# Altium schematic sheet SectionC_BreakOut.SchDoc
size A3
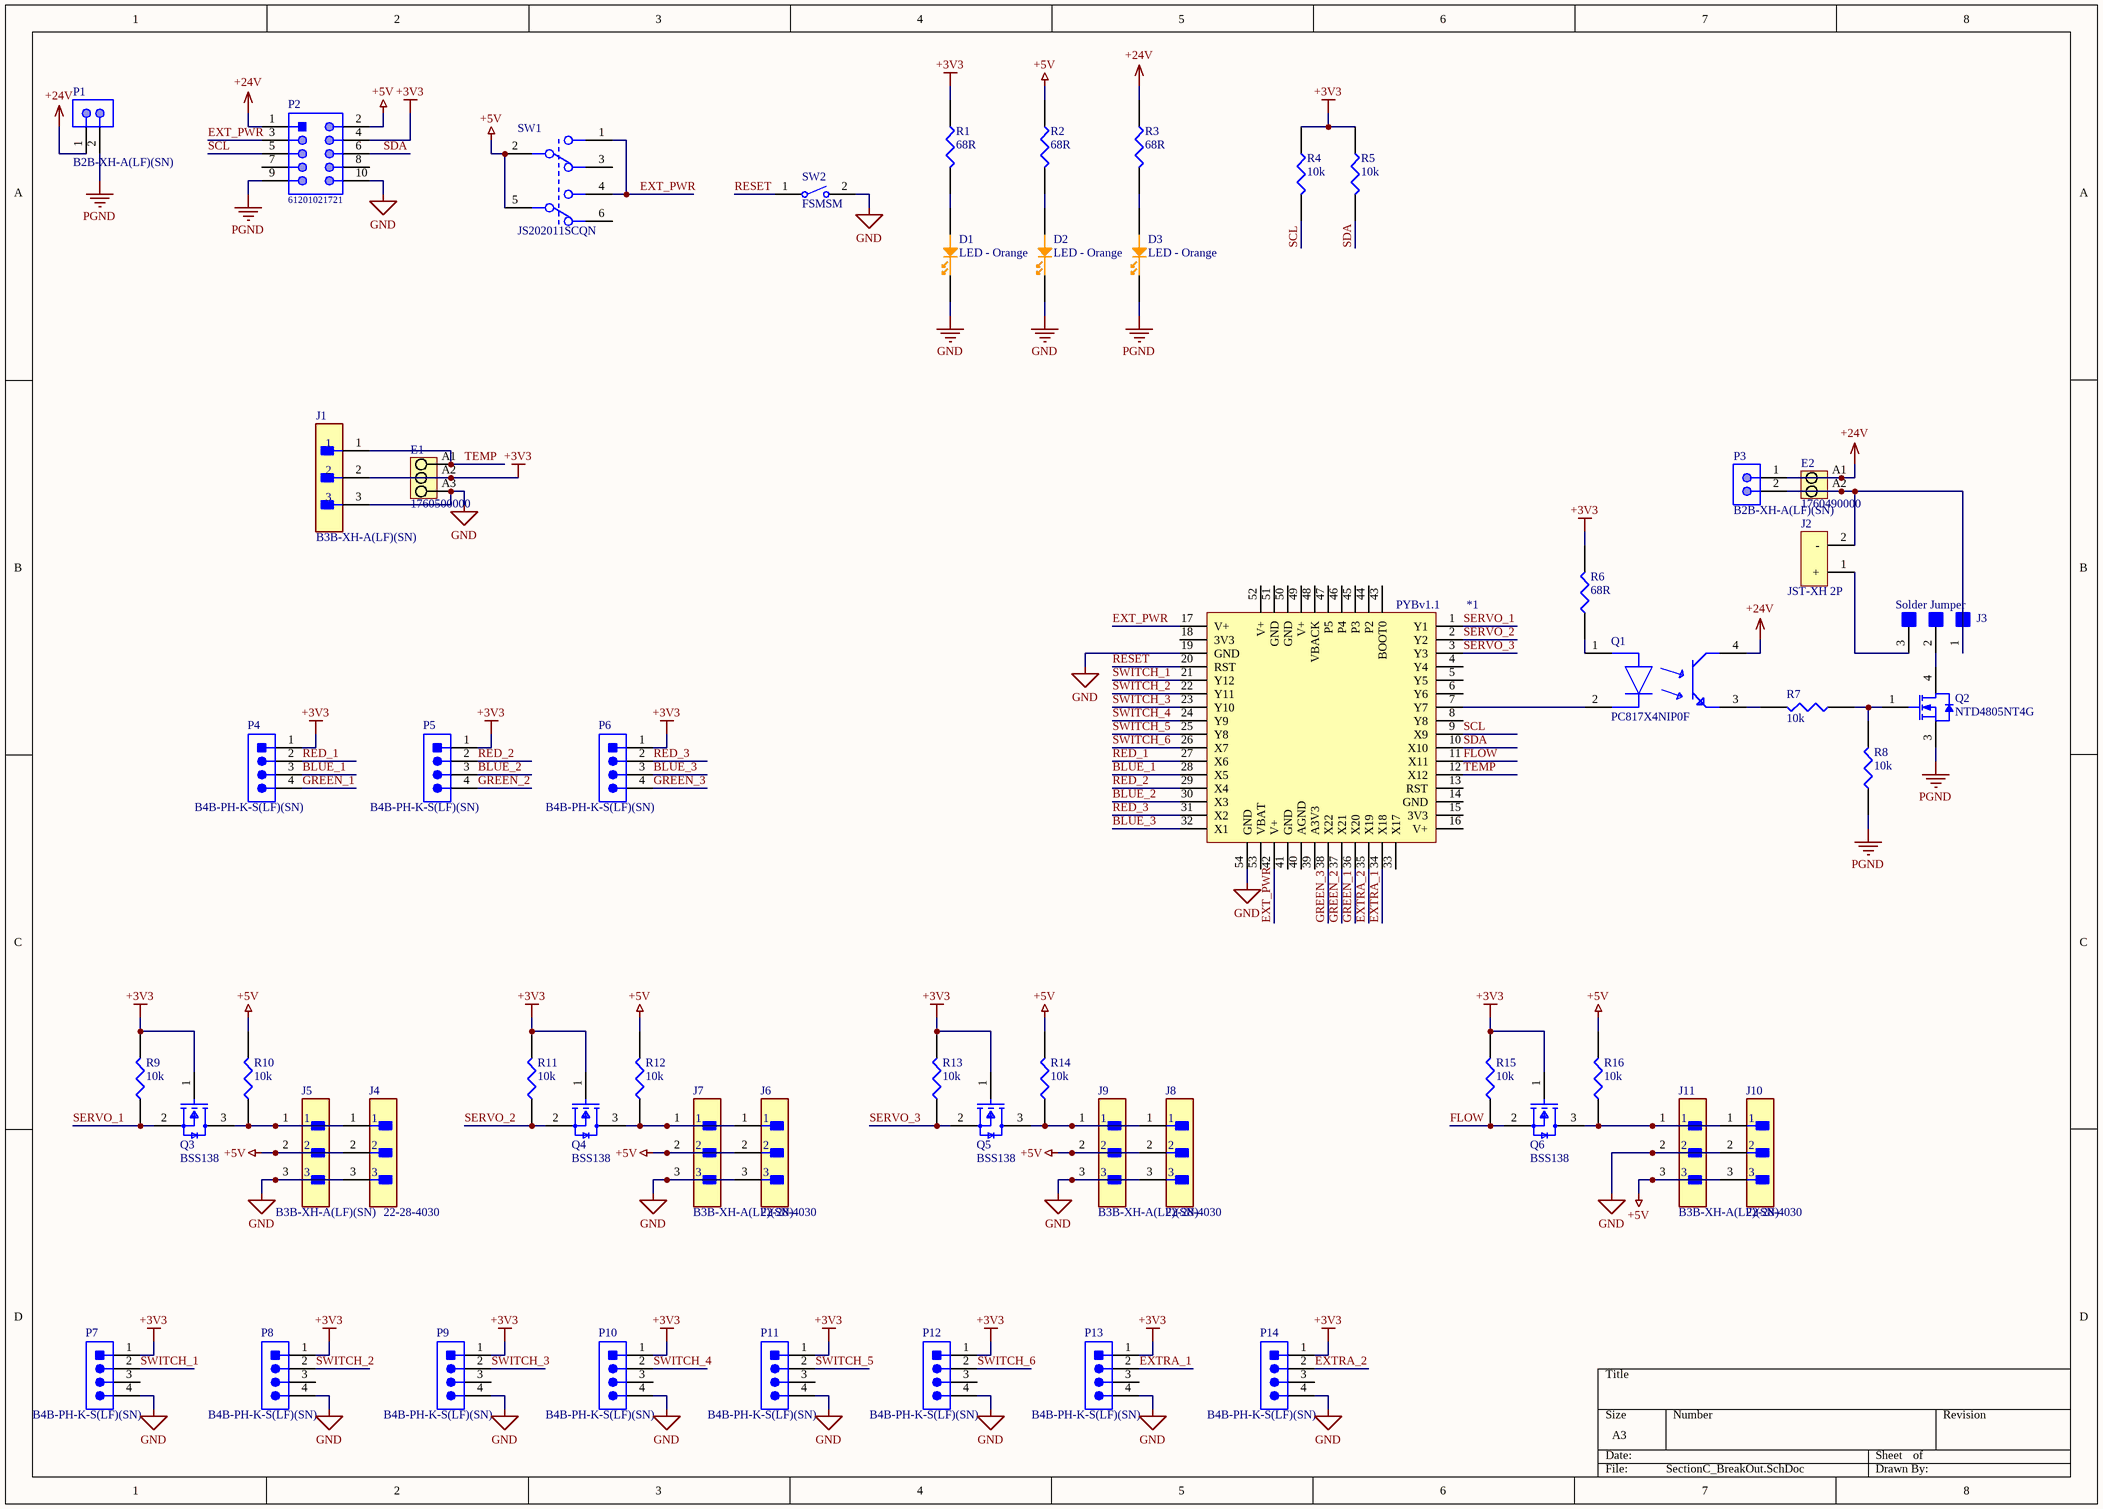
[diagram p0: SectionC_BreakOut.SchDoc]

## Parts
*1  PYBv1.1  [PYBv1.1]
D1  LED - Orange  [LED0603-Orange]
D2  LED - Orange  [LED0603-Orange]
D3  LED - Orange  [LED0603-Orange]
E1  1760500000  [PM_5_08_90_03]
E2  1760490000  [PM_5_08_90_02]
J1  B3B-XH-A(LF)(SN)  [FP-B3B-XH-A_LF_SN-MFG]
J2  JST-XH 2P  [JST-XH 2P]
J3  Solder Jumper  [Solder Jumper]
J4  22-28-4030  [FP-22-28-4030-MFG]
J5  B3B-XH-A(LF)(SN)  [FP-B3B-XH-A_LF_SN-MFG]
J6  22-28-4030  [FP-22-28-4030-MFG]
J7  B3B-XH-A(LF)(SN)  [FP-B3B-XH-A_LF_SN-MFG]
J8  22-28-4030  [FP-22-28-4030-MFG]
J9  B3B-XH-A(LF)(SN)  [FP-B3B-XH-A_LF_SN-MFG]
J10  22-28-4030  [FP-22-28-4030-MFG]
J11  B3B-XH-A(LF)(SN)  [FP-B3B-XH-A_LF_SN-MFG]
P1  B2B-XH-A(LF)(SN)  [JST-B2B-XH-A_V]
P2  61201021721  [61201021721]
P3  B2B-XH-A(LF)(SN)  [JST-B2B-XH-A_V]
P4  B4B-PH-K-S(LF)(SN)  [JST-B4B-PH-K-S_V]
P5  B4B-PH-K-S(LF)(SN)  [JST-B4B-PH-K-S_V]
P6  B4B-PH-K-S(LF)(SN)  [JST-B4B-PH-K-S_V]
P7  B4B-PH-K-S(LF)(SN)  [JST-B4B-PH-K-S_V]
P8  B4B-PH-K-S(LF)(SN)  [JST-B4B-PH-K-S_V]
P9  B4B-PH-K-S(LF)(SN)  [JST-B4B-PH-K-S_V]
P10  B4B-PH-K-S(LF)(SN)  [JST-B4B-PH-K-S_V]
P11  B4B-PH-K-S(LF)(SN)  [JST-B4B-PH-K-S_V]
P12  B4B-PH-K-S(LF)(SN)  [JST-B4B-PH-K-S_V]
P13  B4B-PH-K-S(LF)(SN)  [JST-B4B-PH-K-S_V]
P14  B4B-PH-K-S(LF)(SN)  [JST-B4B-PH-K-S_V]
Q1  PC817X4NIP0F  [FP-PC817X4NIP0F-MFG]
Q2  NTD4805NT4G  [ONSC-DPAK-3-369AA-01_V]
Q3  BSS138  [FP-318-08-IPC_B]
Q4  BSS138  [FP-318-08-IPC_B]
Q5  BSS138  [FP-318-08-IPC_B]
Q6  BSS138  [FP-318-08-IPC_B]
R1  68R  [68R 0603]
R2  68R  [68R 0603]
R3  68R  [68R 0603]
R4  10k  [10k R0603]
R5  10k  [10k R0603]
R6  68R  [68R 0603]
R7  10k  [10k R0603]
R8  10k  [10k R0603]
R9  10k  [10k R0603]
R10  10k  [10k R0603]
R11  10k  [10k R0603]
R12  10k  [10k R0603]
R13  10k  [10k R0603]
R14  10k  [10k R0603]
R15  10k  [10k R0603]
R16  10k  [10k R0603]
SW1  JS202011SCQN  [FP-JS202011SCQN-MFG]
SW2  FSMSM  [TECO-FSMSM-2_V]

## Nets
+3V3: E1.A2 J1.2 P2.4 P4.1 P5.1 P6.1 P7.1 P8.1 P9.1 P10.1 P11.1 P12.1 P13.1 P14.1 Q3.1(G) Q4.1(G) Q5.1(G) Q6.1(G) R1.1 R4.1 R5.1 R6.2 R9.2 R11.2 R13.2 R15.2
+5V: J4.2 J5.2 J6.2 J7.2 J8.2 J9.2 J10.3 J11.3 P2.2 R2.1 R10.2 R12.2 R14.2 R16.2 SW1.2 SW1.5
+24V: E2.A1 P1.1 P2.1 P3.1 Q1.4(C) R3.1
GND: *1.19(GND) *1.54(GND) D1.1(Cathode) D2.1(Cathode) E1.A3 J1.3 J4.3 J5.3 J6.3 J7.3 J8.3 J9.3 J10.2 J11.2 P2.10 P7.4 P8.4 P9.4 P10.4 P11.4 P12.4 P13.4 P14.4 SW2.2
PGND: D3.1(Cathode) P1.2 P2.9 Q2.3(S) R8.1
BLUE_1: *1.28(X5) P4.3
BLUE_2: *1.30(X3) P5.3
BLUE_3: *1.32(X1) P6.3
EXT_PWR: *1.17(V+) *1.42(V+) P2.3 SW1.1 SW1.4
EXTRA_1: *1.34(X18) P13.2
EXTRA_2: *1.35(X19) P14.2
FLOW: *1.11(X11) Q6.2(S) R15.1
GREEN_1: *1.36(X20) P4.4
GREEN_2: *1.37(X21) P5.4
GREEN_3: *1.38(X22) P6.4
RED_1: *1.27(X6) P4.2
RED_2: *1.29(X4) P5.2
RED_3: *1.31(X2) P6.2
RESET: *1.20(RST) SW2.1
SCL: *1.9(X9) P2.5 R4.2
SDA: *1.10(X10) P2.6 R5.2
SERVO_1: *1.1(Y1) Q3.2(S) R9.1
SERVO_2: *1.2(Y2) Q4.2(S) R11.1
SERVO_3: *1.3(Y3) Q5.2(S) R13.1
SWITCH_1: *1.21(Y12) P7.2
SWITCH_2: *1.22(Y11) P8.2
SWITCH_3: *1.23(Y10) P9.2
SWITCH_4: *1.24(Y9) P10.2
SWITCH_5: *1.25(Y8) P11.2
SWITCH_6: *1.26(X7) P12.2
TEMP: *1.12(X12) E1.A1 J1.1
Net*1_7: *1.7(Y7) Q1.2(C)
NetD1_2: D1.2(Anode) R1.2
NetD2_2: D2.2(Anode) R2.2
NetD3_2: D3.2(Anode) R3.2
NetE2_A2: E2.A2 J2.2(-) J3.1 P3.2
NetJ2_1: J2.1(+) J3.3
NetJ3_2: J3.2 Q2.4(D)
NetJ4_1: J4.1 J5.1 Q3.3(D) R10.1
NetJ6_1: J6.1 J7.1 Q4.3(D) R12.1
NetJ8_1: J8.1 J9.1 Q5.3(D) R14.1
NetJ10_1: J10.1 J11.1 Q6.3(D) R16.1
NetQ1_1: Q1.1(A) R6.1
NetQ1_3: Q1.3(E) R7.2
NetQ2_1: Q2.1(G) R7.1 R8.2

Not connected (* = marked no-connect by the designer): *1 4(Y4) 5(Y5) 6(Y6) 8(Y8) 13(RST) 14(GND) 15(3V3) 16(V+) 18(3V3) 33(X17) 39(A3V3) 40(AGND) 41(GND) 43(BOOT0) 44(P2) 45(P3) 46(P4) 47(P5) 48(VBACK) 49(V+) 50(GND) 51(GND) 52(V+) 53(VBAT); P2 7 8; P7 3; P8 3; P9 3; P10 3; P11 3; P12 3; P13 3; P14 3; SW1 3 6

## Library data of the parts
D1-D3 = LTST-C191KFKT: LED ORANGE CLEAR SMD; Manufacturer: Vishay Lite-On; Lens Color: Colorless; Wavelength: 611nm; Number of LEDs: 1; Viewing Angle: 130°; Lens Style: Diffused,Colorless,Rectangular; Luminous Intensity: 90mcd; Forward Current: 30mA; Forward Voltage: 2V; Power Rating: 75mW; Reverse Voltage: 5V; Dominant Wavelength: 605nm; Test Current: 20mA; Supplier 1: Digi-Key; Supplier Part Number 1: 160-1445-1-ND; Manufacturer Part Number: LTST-C191KFKT; RoHS: Yes; Category: LEDs; Stock 1: 92562; Pricing 1: 1=0.24000, 10=0.17900, 100=0.08460, 500=0.05640, 1000=0.04418, 2500=0.04324 (USD); Mount: Surface Mount; Case/Package: 0603; Number of Pins: 2; Case Code (Metric): 1608; Color: Orange; Case Code (Imperial): 0603; Min Operating Temperature: -55°C; Max Operating Temperature: 85°C; Package Quantity: 1; Packaging: Tape and Reel; Illumination Color: Orange; Lens Transparency: Clear; Number of Elements: 1; Power Dissipation: 75mW; Length: 1.6mm; Height: 0.55mm; Width: 0.8mm; Depth: 0.8mm; Radiation Hardening: No; Lead Free: Lead Free; ComponentLink1URL: https://datasheet.ciiva.com/2109/ltst-c191kfkt-2109968.pdf?src-supplier=Digi-Key; ComponentLink1Description: https://datasheet.ciiva.com/2109/ltst-c191kfkt-2109968.pdf?src-supplier=Digi-Key; ComponentLink2URL: https://datasheet.ciiva.com/12400/100-ltst-c191kfkt-39904-12400811.pdf?src-supplier=Mouser; ComponentLink2Description: https://datasheet.ciiva.com/12400/100-ltst-c191kfkt-39904-12400811.pdf?src-supplier=Mouser; ComponentLink3URL: https://datasheet.ciiva.com/11775/0900766b80dc02b0-11775613.pdf?src-supplier=RSComponents; ComponentLink3Description: https://datasheet.ciiva.com/11775/0900766b80dc02b0-11775613.pdf?src-supplier=RSComponents; ComponentLink4URL: https://datasheet.ciiva.com/15201/getdatasheetpartid-631075-15201391.pdf?src-supplier=Verical; ComponentLink4Description: https://datasheet.ciiva.com/15201/getdatasheetpartid-631075-15201391.pdf?src-supplier=Verical; ComponentLink5URL: https://datasheet.ciiva.com/2109/s-110-ltst-c191kfkt-2109969.pdf?src-supplier=Digi-Key; ComponentLink5Description: https://datasheet.ciiva.com/2109/s-110-ltst-c191kfkt-2109969.pdf?src-supplier=Digi-Key
E1 = CMP-1559-01629-1: OMNIMATE Signal - series PM; Manufacturer: Weidmueller; Pitch_mm: 5,08 mm; Pitch_inch: 0,2 inch; Wire_cross_section_AWG_min_UL_1059: AWG 26; Contact_surface: tinned; Contact_material: Cu-Leg; Short_text_for_material: PM 5.08/03/90 3.5SN OR BX; Rated_voltage_use_group_B_UL_1059: 300 V; Solid_min_H05_07_V_U: 0,13 mm²; Solder_pin_length_mm: 3,5 mm; Rated_voltage_for_surge_voltage_class_pollution_degree_II_2: 600 V; Mounting_onto_the_PCB: Solder connection; Solid_max_H05_07_V_U: 2,5 mm²; Side_termination_characteristic: closed side; Rated_current_use_group_B_UL_1059: 15 A; Wire_cross_section_AWG_max_UL_1059: AWG 14; Insulating_material: Wemid (PA); UL_94_flammability_rating: V-0; No_of_poles: 3; ComponentLink2Description: URL Link1; ComponentLink1Description: Manufacturer URL; PartNumber: 1760500000; ComponentLink2URL: http://catalog.weidmueller.com/catalog/Start.do?localeId=en&ObjectID=1760500000; ComponentLink1URL: http://www.weidmueller.com/; Qty: 500 PCS; Colour: Orange; Packaging: Box; Revision: V1; PackageReference: PM_5_08_90_03
E2 = CMP-1559-01627-1: OMNIMATE Signal - series PM; Manufacturer: Weidmueller; Contact_surface: tinned; Pitch_mm: 5,08 mm; Solid_min_H05_07_V_U: 0,13 mm²; Wire_cross_section_AWG_min_UL_1059: AWG 26; Wire_cross_section_AWG_max_UL_1059: AWG 14; Rated_voltage_for_surge_voltage_class_pollution_degree_II_2: 600 V; Rated_current_use_group_B_UL_1059: 15 A; Mounting_onto_the_PCB: Solder connection; Solder_pin_length_mm: 3,5 mm; Side_termination_characteristic: closed side; Contact_material: Cu-Leg; Pitch_inch: 0,2 inch; No_of_poles: 2; UL_94_flammability_rating: V-0; Insulating_material: Wemid (PA); Rated_voltage_use_group_B_UL_1059: 300 V; Solid_max_H05_07_V_U: 2,5 mm²; Short_text_for_material: PM 5.08/02/90 3.5SN OR BX; Revision: V1; PartNumber: 1760490000; Qty: 500 PCS; ComponentLink2Description: URL Link1; Packaging: Box; PackageReference: PM_5_08_90_02; ComponentLink2URL: http://catalog.weidmueller.com/catalog/Start.do?localeId=en&ObjectID=1760490000; Colour: Orange; ComponentLink1Description: Manufacturer URL; ComponentLink1URL: http://www.weidmueller.com/
J1 J5 J7 J9 J11 = CMP-17439-000014-1: CONN HEADER VERT 3POS 2.5MM; Manufacturer: JST; Conn Gender: Male; Conn Orientation: Vertical; Voltage Rating: 250V; Number Of Contacts: 3; Current Rating: 3A; Contact Material: Tin,Copper; Temperature Range Low: -25°C; Octopart: https://octopart.com/b3b-xh-a%28lf%29%28sn%29-jst-3990185; Device Class L3: unset; Device Class L1: Connectors; Lead Free: Yes; Temperature: -25°C to +85°C; Manufacturer Part Number: B3B-XH-A(LF)(SN); Package: 0; ComponentLink2Description: Datasheet; Pitch: 2.5mm; RoHS: TRUE; Category: Conn; Automotive: No; Temperature Range High: +85°C; Height: 7mm; Device Class L2: Headers and Wire Housings; Number Of Rows: 1; Digikey Description: CONN HEADER VERT 3POS 2.5MM; ComponentLink2URL: https://www.jst-mfg.com/product/pdf/eng/eXH.pdf
J2 = B2B-XH-A(LF)(SN): JST-XH 2 POS 2.5mm Solder ST Thru-Hole Box; Manufacturer: JST; Number of Positions: 2; Connector Type: Male Pin; Contact Resistance: 20mR; Max Current Rating: 3A; Max Voltage Rating (AC): 250V; Insulation Resistance: 1GR; Wire/Cable Gauge: 22AWG; Supplier 1: Element14; Supplier Part Number 1: 1516276; Manufacturer Part Number: B2B-XH-A(LF)(SN); RoHS: Yes; Category: FFC / FPC; Stock 1: 165899; Mount: Through Hole; Contact Plating: Tin,Copper,Lead; Color: Natural; Contact Material: Brass; Housing Color: White; Housing Material: Polyamide; Min Operating Temperature: -25°C; Max Operating Temperature: 85°C; Number of Rows: 1; Packaging: Bulk; Termination: Solder; Fastening Type: Detent; Orientation: Straight; Current Rating: 3A; Voltage Rating: 250V; Voltage Rating (AC): 250V; Number of Contacts: 2; Max Voltage Rating (DC): 250V; Length: 7.4mm; Pitch: 2.5mm; Depth: 5.75mm; Lead Pitch: 2.5mm; Lead Free: Lead Free; REACH SVHC: No SVHC; ComponentLink1URL: https://datasheet.ciiva.com/26894/getdatasheetpartid-640357-26894434.pdf?src-supplier=Verical; ComponentLink1Description: https://datasheet.ciiva.com/26894/getdatasheetpartid-640357-26894434.pdf?src-supplier=Verical; ComponentLink2URL: https://datasheet.ciiva.com/11746/0900766b8082653e-11746979.pdf?src-supplier=RSComponents; ComponentLink2Description: https://datasheet.ciiva.com/11746/0900766b8082653e-11746979.pdf?src-supplier=RSComponents; ComponentLink3URL: https://datasheet.ciiva.com/26894/getdatasheetpartid-385291-26894760.pdf?src-supplier=Verical; ComponentLink3Description: https://datasheet.ciiva.com/26894/getdatasheetpartid-385291-26894760.pdf?src-supplier=Verical; ComponentLink4URL: https://datasheet.ciiva.com/8052/5448-8052024.pdf?src-supplier=Element14; ComponentLink4Description: https://datasheet.ciiva.com/8052/5448-8052024.pdf?src-supplier=Element14; ComponentLink5URL: https://datasheet.ciiva.com/20207/523653-20207167.pdf?src-supplier=Rapid+Electronics; ComponentLink5Description: https://datasheet.ciiva.com/20207/523653-20207167.pdf?src-supplier=Rapid+Electronics
J4 J6 J8 J10 = CMP-04776-000098-1: CONN HEADER VERT 3POS 2.54MM; Manufacturer: Molex; Conn Orientation: Vertical; Conn Gender: Male; Current Rating: 4A; Voltage Rating: 500V; Number Of Contacts: 3; Category: Conn; Number Of Rows: 1; Manufacturer Part Number: 22-28-4030; RoHS: TRUE; Package: 22-28-4030; Footprint Url: https://www.molex.com/pdm_docs/sd/022284030_sd.pdf; ComponentLink2Description: Datasheet; Device Class L2: Headers and Wire Housings; Automotive: No; Temperature Range Low: -40°C; Digikey Description: CONN HEADER VERT 3POS 2.54MM; Mouser Description: Headers & Wire Housings 3P VERT HEADER Sn; Contact Material: Gold,Nickel; Pitch: 2.54mm; Device Class L1: Connectors; Lead Free: Yes; Device Class L3: unset; Temperature Range High: +80°C; Octopart: https://octopart.com/0022284030-molex-10476094; ComponentLink2URL: https://www.molex.com/webdocs/datasheets/pdf/en-us/0022284030_PCB_HEADERS.pdf; Height: 8.88mm; Temperature: -40°C to +80°C
P1 P3 = CMP-2000-05888-1: Male Header, Pitch 2.5 mm, 1 x 2 Position, Height 7 mm, Tail Length 3.4 mm, -25 to 85 degC, RoHS, Bulk; Manufacturer: JST; No of Positions: 2; Pitch: 2.5mm; Style/Orientation: StraightHeader/Plug; Datasheet Version: 05/2016; Package Description: Male Header, Pitch 2.5 mm, 1 x 2 Position, Height 7 mm, Tail Length 3.4 mm; Package Reference: B2B-XH-A; Mounting Technology: ThroughHole; Type: ShroudedHeader; Datasheet URL: http://www.jst-mfg.com/product/pdf/eng/eXH.pdf; Manufacturer URL: http://www.jst.com/home2.html; Termination: Crimp
P2 = CMP-1502-00021-1: Male Box Header WR-BHD, THT, Angled, pitch 2.54 mm, 10 pins; Manufacturer: Wurth Elektronik; Pin Number: 10; Contact Resistance: 20mOhm; Working Voltage: 250VAC; Pitch: 2.54mm; Withstanding Voltage: 500VAC; Mounting Technology: THT; Publisher: WurthElektronik; Gender: Male; Part Number: 61201021721; Package Reference: 61201021721; Orientation: Angled; Published Date: August2018; Packaging: Tray; Manufacturer URL: http://www.we-online.de; Operating Temperature: -40to125degC; Datasheet URL: https://katalog.we-online.de/em/datasheet/6120xx21721.pdf
P4-P14 = CMP-2000-05165-1: Male Header, Pitch 2 mm, 1 x 4 Position, Height 6 mm, Tail Length 3.4 mm, -25 to 85 degC, RoHS, Bulk; Manufacturer: JST; No of Positions: 4; Style/Orientation: StraightHeader/Plug; Pitch: 2mm; Datasheet URL: http://datasheet.octopart.com/B4B-PH-K-S%28LF%29%28SN%29-JST-datasheet-10558886.pdf; Type: ShroudedHeader; Manufacturer URL: http://www.jst.com/home2.html; Termination: Crimp; Datasheet Version: Apr-09
Q1 = CMP-65434-000001-1: OPTOISOLATOR 5KV TRANS 4SMD; Manufacturer: Sharp; Collector Emitter Voltage: 80V; Standoff Height: 0.1mm; Power Dissipation: 200mW; Min Current Transfer Ratio: 50%; Reverse Voltage: 6V; Forward Current: 20mA; Forward Voltage: 1.2V; Max Current Transfer Ratio: 600%; Isolation Voltage: 5kVrms; Mouser Description: Transistor Output Optocouplers Photocoupler 300-600% CRT; RoHS: TRUE; ComponentLink2URL: https://www.sharpsde.com/fileadmin/products/Optoelectronics/Isolation%20Devices/Specs%20Photocoupler/PC817XxNIP0F_17Jun08_Spec_ED-04P129A.pdf; Lead Free: Yes; Device Class L1: Optoelectronics; ComponentLink2Description: Datasheet; Device Class L2: Optocouplers; Temperature: -30°C to +100°C; Temperature Range Low: -30°C; Automotive: No; Temperature Range High: +100°C; Octopart: https://octopart.com/pc817x4nip0f-sharp-20650453; Height: 4.6mm; Digikey Description: OPTOISOLATOR 5KV TRANS 4SMD; Category: Trans; Device Class L3: unset; Package: PC817X4NIP0F; Manufacturer Part Number: PC817X4NIP0F; Emiiter Collector Voltage: 6V
Q2 = CMP-1058-00313-1: Power MOSFET, 30 V, 88 A, Single N-Channel, 3-Pin DPAK, Pb-Free, Tape and Reel; Manufacturer: On Semiconductor; Qrr Typ (nC): 18; Coss Typ (pF): 610; VGS(th) Max (V): 2.5; Channel Polarity: N Channel; Crss Typ (pF): 338; V(BR)DSS Min (V): 30; VGS Max (V): 20; ID Max (A): 88; Ciss Typ (pF): 2865; ComponentLink1Description: Manufacturer URL; Configuration: Single; PackageDescription: 3-Pin Flange Mount, Body 6.54 x 6.095 mm, Pitch 2.29 mm; RoHS: Pb-Free; DatasheetVersion: Rev. 7; Mounting Technology: Surface Mount; PackageVersion: Rev. B, 06/2010; ComponentLink1URL: http://www.onsemi.com/; ComponentLink3Description: Package Specification; ComponentLink2URL: http://www.onsemi.cn/pub_link/Collateral/NTD4805N-D.PDF; Packing: Tape and Reel; Package Type: DPAK-3, IPAK-4; PartNumber: NTD4805NT4G; ComponentLink3URL: http://www.onsemi.cn/pub_link/Collateral/369AA.PDF; PackageReference: DPAK-3-369AA-01; ComponentLink2Description: Datasheet
Q3-Q6 = CMP-07173-000101-1: MOSFET N-CH 50V 220MA SOT-23; Turn-Off Delay Time: 20ns; Element Configuration: Single; Rds On Max: 3.5R; Gate to Source Voltage (Vgs): 20V; Threshold Voltage: 1.3V; Number of Elements: 1; Power Dissipation: 360mW; Rise Time: 9ns; Turn-On Delay Time: 2.5ns; Input Capacitance: 27pF; On-State Resistance: 6R; Lead Free: Lead Free; Length: 2.92mm; Width: 1.3mm; Drain to Source Breakdown Voltage: 50V; Min Operating Temperature: -55°C; REACH SVHC: No SVHC; Packaging: Tape and Reel; Radiation Hardening: No; Height: 0.93mm; Drain to Source Voltage (Vdss): 50V; Current Rating: 220mA; Voltage Rating (DC): 50V; Weight: 0.03g; Continuous Drain Current (ID): 220mA; Number of Pins: 3; Nominal Vgs: 1.3V; Max Power Dissipation: 360mW; Fall Time: 9ns; Drain to Source Resistance: 3.5R; Contact Plating: Tin; Case/Package: SOT-23; Package Quantity: 1; Dual Supply Voltage: 50V; Mount: Surface Mount; Termination: SMD/SMT; Max Operating Temperature: 150°C
R1-R3 R6 = CRGP0603F68R: CRGP 0603 68R 1%; Manufacturer: TE Connectivity; Max Power Dissipation: 250mW; Temperature Coefficient: 200ppm/°C; Supplier 1: Digi-Key; Supplier Part Number 1: A130402CT-ND; Manufacturer Part Number: CRGP0603F68R; RoHS: No; Category: Chip SMD Resistors; Stock 1: 49308; Pricing 1: 1=0.14000, 10=0.11400, 100=0.04470, 1000=0.01870, 2500=0.01714 (USD); Case/Package: 0603; Case Code (Imperial): 0603; Case Code (Metric): 1608; Min Operating Temperature: -55°C; Max Operating Temperature: 155°C; Resistor Type: Thick Film; Packaging: Tape and Reel; Resistance: 68R; Tolerance: 1%; Number of Terminations: 2; ComponentLink1URL: https://www.te.com/commerce/DocumentDelivery/DDEController?Action=srchrtrv&amp;DocNm=9-1773463-9&amp;DocType=DS&amp;DocLang=English&src-supplier=Digi-Key; ComponentLink1Description: https://www.te.com/commerce/DocumentDelivery/DDEController?Action=srchrtrv&amp;DocNm=9-1773463-9&amp;DocType=DS&amp;DocLang=English&src-supplier=Digi-Key
R4 R5 R7-R16 = CRG0603F10K/10: RES 10.0K OHM 1/10W 1% 0603; Manufacturer: TE Connectivity; Voltage Rating: 50V; Number of Resistors: 1; Resistance: 10kR; Power Rating: 100mW; Temperature Coefficient: 100ppm/°C; Supplier 1: Digi-Key; Supplier Part Number 1: A121523CT-ND; Manufacturer Part Number: CRG0603F10K/10; RoHS: Yes; Category: Chip SMD Resistors; Stock 1: 172089; Pricing 1: 1=0.10000, 10=0.03100, 100=0.01270, 1000=0.00570, 2500=0.00494, 5000=0.00409 (USD); Mount: Surface Mount; Case/Package: 0603; Weight: 7.1E-05oz; Case Code (Imperial): 0603; Min Operating Temperature: -55°C; Max Operating Temperature: 125°C; Resistor Type: Thick Film; Number of Terminations: 2; Termination: Solder; Packaging: Tape and Reel; Tolerance: 1%; Package Quantity: 10000; Max Power Dissipation: 100mW; Length: 1.6mm; Height: 0.022inch; Depth: 0.8mm; Width: 0.8mm; Radiation Hardening: No; Military Standard: Not; ELV: Compliant; ComponentLink1URL: https://datasheet.ciiva.com/2530/eng-cd-1622829-ba-2530062.pdf?src-supplier=Digi-Key; ComponentLink1Description: https://datasheet.ciiva.com/2530/eng-cd-1622829-ba-2530062.pdf?src-supplier=Digi-Key
SW1 = CMP-10038-000011-1: SWITCH SLIDE DPDT 300MA 6V; Actuator Material: Nylon; Actuator Length: 2mm; Actuator Type: Standard; Contact Resistance: 70mR; Switch Function: On-On; Electrical Life: 5000Cycles; Voltage Rating (DC): 6V; Contact Current Rating: 300mA; Contact Plating: Silver; Throw Configuration: DPDT; REACH SVHC: No SVHC; Length: 9mm; Package Quantity: 1; Min Operating Temperature: -20°C; Contact Material: Copper Alloy; Switch Travel: 2mm; Radiation Hardening: No; Depth: 7.5mm; Packaging: Tape and Reel; Max Voltage Rating (DC): 6V; Housing Material: Nylon; Max Operating Temperature: 85°C; Current Rating: 300mA; Orientation: Vertical; Termination: Gull Wing; Flammability Rating: UL94 V-2; Lead Free: Lead Free; Mount: Surface Mount; Max Current Rating: 300mA
SW2 = CMP-2000-07511-1: FSMSM Push Button Switch, 50 mA, -35 to 85 degC, 2-Pin SMD, RoHS, Bulk; Manufacturer: TE Connectivity; Actuator Length: 1.07mm; Electrical Life: 20000Cycles; Actuator Material: Polyamide; Current Rating: 50mA; Illumination Type: Illuminated; Voltage Rating (DC): 24V; Contact Resistance: 100mOhm; Case\/Package: SMD/SMT; Operating Force: 180gf; Switch Travel: 0.25mm; Max Voltage Rating (DC): 12V; Throw Configuration: SPST; Packaging: LoosePiece; Max Operating Temperature: 85degC; ELV: Compliant; Package Description: 2-Pin Surface Mount Device, Body 6 x 3.5 mm, Pitch 9.19 mm; RoHSCompliant: true; Manufacturer URL: http://www.te.com/; Contact Plating: Silver; Contact Material: Brass; Mounting Technology: SurfaceMount; Contact Current Rating: 50mA; Datasheet Version: Rev. C2, 08/2014; Datasheet URL: http://www.te.com/commerce/DocumentDelivery/DDEController?Action=showdoc&DocId=Customer+Drawing%7F1437566-3%7FC2%7Fpdf%7FEnglish%7FENG_CD_1437566-3_C2_1437566_3_1_c.dwg.pdf%7F1437566-3; Mechanical Life: 20000Cycles; Package Reference: FSMSM; REACH SVHC: Unknown; Orientation: Straight; Min Operating Temperature: -35degC; Lead Free: LeadFree; Termination: GullWing; Package Quantity: 1000; Mount: SurfaceMount